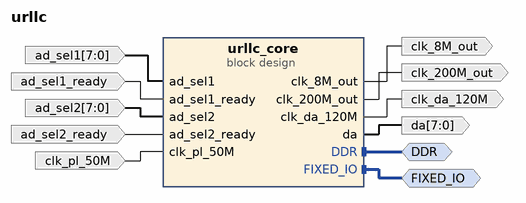
[diagram p0: block diagram of the top level]
# Vivado block design urllc, xc7z020clg400-2, Vivado 2021.1
create_bd_design urllc

create_bd_intf_port -mode Master -vlnv xilinx.com:interface:ddrx_rtl:1.0 DDR
create_bd_intf_port -mode Master -vlnv xilinx.com:display_processing_system7:fixedio_rtl:1.0 FIXED_IO
create_bd_port -dir O -from 7 -to 0 -type data da
create_bd_port -dir I -from 7 -to 0 -type data ad_sel1
create_bd_port -dir I -from 7 -to 0 -type data ad_sel2
create_bd_port -dir O -type clk clk_200M_out
set_property -dict {CONFIG.FREQ_HZ 200000000} [get_bd_ports clk_200M_out]
create_bd_port -dir I -type intr ad_sel1_ready
set_property -dict {CONFIG.SENSITIVITY EDGE_RISING} [get_bd_ports ad_sel1_ready]
create_bd_port -dir I -type intr ad_sel2_ready
set_property -dict {CONFIG.SENSITIVITY EDGE_RISING} [get_bd_ports ad_sel2_ready]
create_bd_port -dir I -type clk clk_pl_50M
set_property -dict {CONFIG.FREQ_HZ 50000000} [get_bd_ports clk_pl_50M]
create_bd_port -dir O -type clk clk_da_120M
create_bd_port -dir O -type clk clk_8M_out

create_bd_cell -type container -reference urllc_core urllc_core
set_property -dict [list \
  CONFIG.ACTIVE_SIM_BD urllc_core.bd \
  CONFIG.ACTIVE_SYNTH_BD urllc_core.bd \
  CONFIG.ENABLE_DFX 0 \
  CONFIG.LIST_SIM_BD urllc_core.bd \
  CONFIG.LIST_SYNTH_BD urllc_core.bd \
  CONFIG.LOCK_PROPAGATE 0 \
] [get_bd_cells urllc_core]

# ---- connections ----

connect_bd_intf_net -intf_net processing_system7_0_DDR [get_bd_intf_ports DDR] [get_bd_intf_pins urllc_core/DDR]
connect_bd_intf_net -intf_net processing_system7_0_FIXED_IO [get_bd_intf_ports FIXED_IO] [get_bd_intf_pins urllc_core/FIXED_IO]
connect_bd_net -net ad_sel1_1 [get_bd_ports ad_sel1] [get_bd_pins urllc_core/ad_sel1]
connect_bd_net [get_bd_ports ad_sel1_ready] [get_bd_pins urllc_core/ad_sel1_ready]
connect_bd_net -net ad_sel2_1 [get_bd_ports ad_sel2] [get_bd_pins urllc_core/ad_sel2]
connect_bd_net [get_bd_ports ad_sel2_ready] [get_bd_pins urllc_core/ad_sel2_ready]
connect_bd_net [get_bd_ports clk_pl_50M] [get_bd_pins urllc_core/clk_pl_50M]
connect_bd_net -net clk_wiz_0_clk_out_200M [get_bd_pins urllc_core/clk_200M_out] [get_bd_ports clk_200M_out]
connect_bd_net -net data_area_da [get_bd_pins urllc_core/da] [get_bd_ports da]
connect_bd_net -net div_n_0_clk_div2 [get_bd_pins urllc_core/clk_8M_out] [get_bd_ports clk_8M_out]
connect_bd_net -net multi_clock_clk_out_120M [get_bd_pins urllc_core/clk_da_120M] [get_bd_ports clk_da_120M]

# ---- address map ----
assign_bd_address -offset 0x00000000 -range 512M -target_address_space [get_bd_addr_spaces urllc_core/data_area/reciever/axi_dma_1/Data_MM2S] [get_bd_addr_segs urllc_core/processing_system7_0/S_AXI_HP0/HP0_DDR_LOWOCM]
exclude_bd_addr_seg -offset 0x40400000 -range 64K -target_address_space [get_bd_addr_spaces urllc_core/data_area/reciever/axi_dma_1/Data_MM2S] [get_bd_addr_segs urllc_core/data_area/reciever/axi_dma_1/S_AXI_LITE/Reg]
exclude_bd_addr_seg -offset 0x40410000 -range 64K -target_address_space [get_bd_addr_spaces urllc_core/data_area/reciever/axi_dma_1/Data_MM2S] [get_bd_addr_segs urllc_core/data_area/sender/axi_dma_0/S_AXI_LITE/Reg]
assign_bd_address -offset 0x00000000 -range 512M -target_address_space [get_bd_addr_spaces urllc_core/data_area/reciever/axi_dma_1/Data_S2MM] [get_bd_addr_segs urllc_core/processing_system7_0/S_AXI_HP0/HP0_DDR_LOWOCM]
exclude_bd_addr_seg -offset 0x40400000 -range 64K -target_address_space [get_bd_addr_spaces urllc_core/data_area/reciever/axi_dma_1/Data_S2MM] [get_bd_addr_segs urllc_core/data_area/reciever/axi_dma_1/S_AXI_LITE/Reg]
exclude_bd_addr_seg -offset 0x40410000 -range 64K -target_address_space [get_bd_addr_spaces urllc_core/data_area/reciever/axi_dma_1/Data_S2MM] [get_bd_addr_segs urllc_core/data_area/sender/axi_dma_0/S_AXI_LITE/Reg]
assign_bd_address -offset 0x00000000 -range 512M -target_address_space [get_bd_addr_spaces urllc_core/data_area/sender/axi_dma_0/Data_MM2S] [get_bd_addr_segs urllc_core/processing_system7_0/S_AXI_HP0/HP0_DDR_LOWOCM]
exclude_bd_addr_seg -offset 0x40400000 -range 64K -target_address_space [get_bd_addr_spaces urllc_core/data_area/sender/axi_dma_0/Data_MM2S] [get_bd_addr_segs urllc_core/data_area/reciever/axi_dma_1/S_AXI_LITE/Reg]
exclude_bd_addr_seg -offset 0x40410000 -range 64K -target_address_space [get_bd_addr_spaces urllc_core/data_area/sender/axi_dma_0/Data_MM2S] [get_bd_addr_segs urllc_core/data_area/sender/axi_dma_0/S_AXI_LITE/Reg]
assign_bd_address -offset 0x00000000 -range 512M -target_address_space [get_bd_addr_spaces urllc_core/data_area/sender/axi_dma_0/Data_S2MM] [get_bd_addr_segs urllc_core/processing_system7_0/S_AXI_HP0/HP0_DDR_LOWOCM]
exclude_bd_addr_seg -offset 0x40400000 -range 64K -target_address_space [get_bd_addr_spaces urllc_core/data_area/sender/axi_dma_0/Data_S2MM] [get_bd_addr_segs urllc_core/data_area/reciever/axi_dma_1/S_AXI_LITE/Reg]
exclude_bd_addr_seg -offset 0x40410000 -range 64K -target_address_space [get_bd_addr_spaces urllc_core/data_area/sender/axi_dma_0/Data_S2MM] [get_bd_addr_segs urllc_core/data_area/sender/axi_dma_0/S_AXI_LITE/Reg]
assign_bd_address -offset 0x40400000 -range 64K -target_address_space [get_bd_addr_spaces urllc_core/processing_system7_0/Data] [get_bd_addr_segs urllc_core/data_area/reciever/axi_dma_1/S_AXI_LITE/Reg]
assign_bd_address -offset 0x40410000 -range 64K -target_address_space [get_bd_addr_spaces urllc_core/processing_system7_0/Data] [get_bd_addr_segs urllc_core/data_area/sender/axi_dma_0/S_AXI_LITE/Reg]
assign_bd_address -offset 0x81200000 -range 64K -target_address_space [get_bd_addr_spaces urllc_core/processing_system7_0/Data] [get_bd_addr_segs urllc_core/debug_ports/axi_gpio_0/S_AXI/Reg]
assign_bd_address -offset 0x81210000 -range 64K -target_address_space [get_bd_addr_spaces urllc_core/processing_system7_0/Data] [get_bd_addr_segs urllc_core/debug_ports/axi_gpio_1/S_AXI/Reg]
assign_bd_address -offset 0x83C00000 -range 64K -target_address_space [get_bd_addr_spaces urllc_core/processing_system7_0/Data] [get_bd_addr_segs urllc_core/multi_clock/clk_wiz_dynamic/s_axi_lite/Reg]

validate_bd_design
save_bd_design
